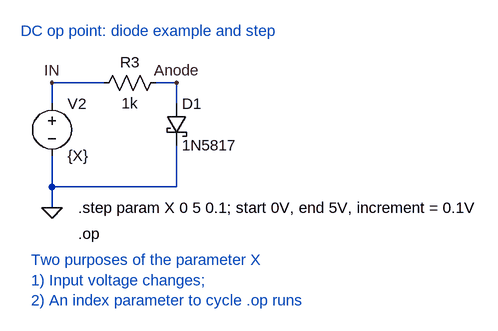
[diagram p0: schematic LTspice 03-1 DC op point example3.asc]
LTspice 03-1 DC op point example3.asc, the LTspice schematic file:
Version 4
SHEET 1 2084 680
WIRE 944 240 864 240
WIRE 1056 240 1024 240
WIRE 864 272 864 240
WIRE 1056 272 1056 240
WIRE 864 400 864 352
WIRE 1056 400 1056 336
WIRE 1056 400 864 400
WIRE 864 432 864 400
FLAG 864 432 0
FLAG 864 240 IN
FLAG 1056 240 Anode
SYMBOL voltage 864 256 R0
WINDOW 123 0 0 Left 2
WINDOW 39 0 0 Left 2
SYMATTR InstName V2
SYMATTR Value {X}
SYMBOL res 928 256 R270
WINDOW 0 32 56 VTop 2
WINDOW 3 0 56 VBottom 2
SYMATTR InstName R3
SYMATTR Value 1k
SYMBOL schottky 1040 272 R0
SYMATTR InstName D1
SYMATTR Value 1N5817
SYMATTR Description Diode
SYMATTR Type diode
TEXT 816 160 Left 2 ;DC op point: diode example and step
TEXT 904 472 Left 2 !.op
TEXT 904 432 Left 2 !.step param X 0 5 0.1; start 0V, end 5V, increment = 0.1V
TEXT 832 512 Left 2 ;Two purposes of the parameter X\n1) Input voltage changes; \n2) An index parameter to cycle .op runs

The netlist it stands for:
* LTspice 03-1 DC op point example3.asc
V2 IN 0 {X}
R3 IN Anode 1k
D1 Anode 0 1N5817
.model D D
.lib standard.dio
* DC op point: diode example and step
.op
.step param X 0 5 0.1; start 0V, end 5V, increment = 0.1V
* Two purposes of the parameter X
* 1) Input voltage changes;
* 2) An index parameter to cycle .op runs
.backanno
.end